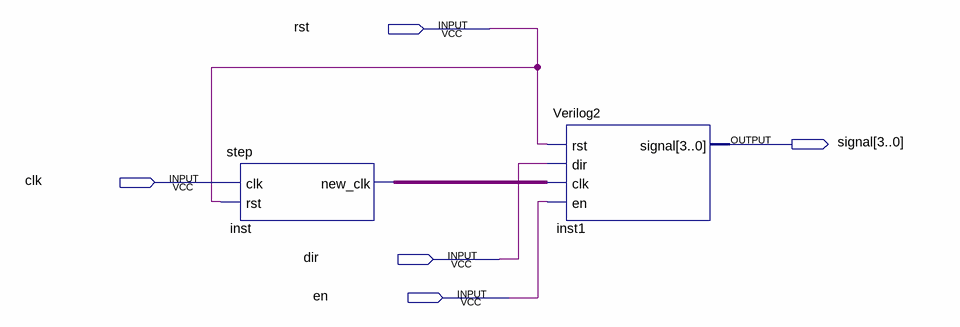
[diagram p0: schematic sheet]
// Quartus schematic Block1.bdf as structural Verilog: 2 symbols, 5 pins
module Block1 (
  input  rst,
  input  clk,
  input  dir,
  input  en,
  output [3:0] signal
);

  wire inst_new_clk;

  step inst (.clk(clk), .rst(rst), .new_clk(inst_new_clk));
  Verilog2 inst1 (.rst(rst), .dir(dir), .clk(inst_new_clk), .en(en), .signal(signal));
endmodule
